# EAGLE design eCog108_Keyfob (EAGLE 6.6.0)
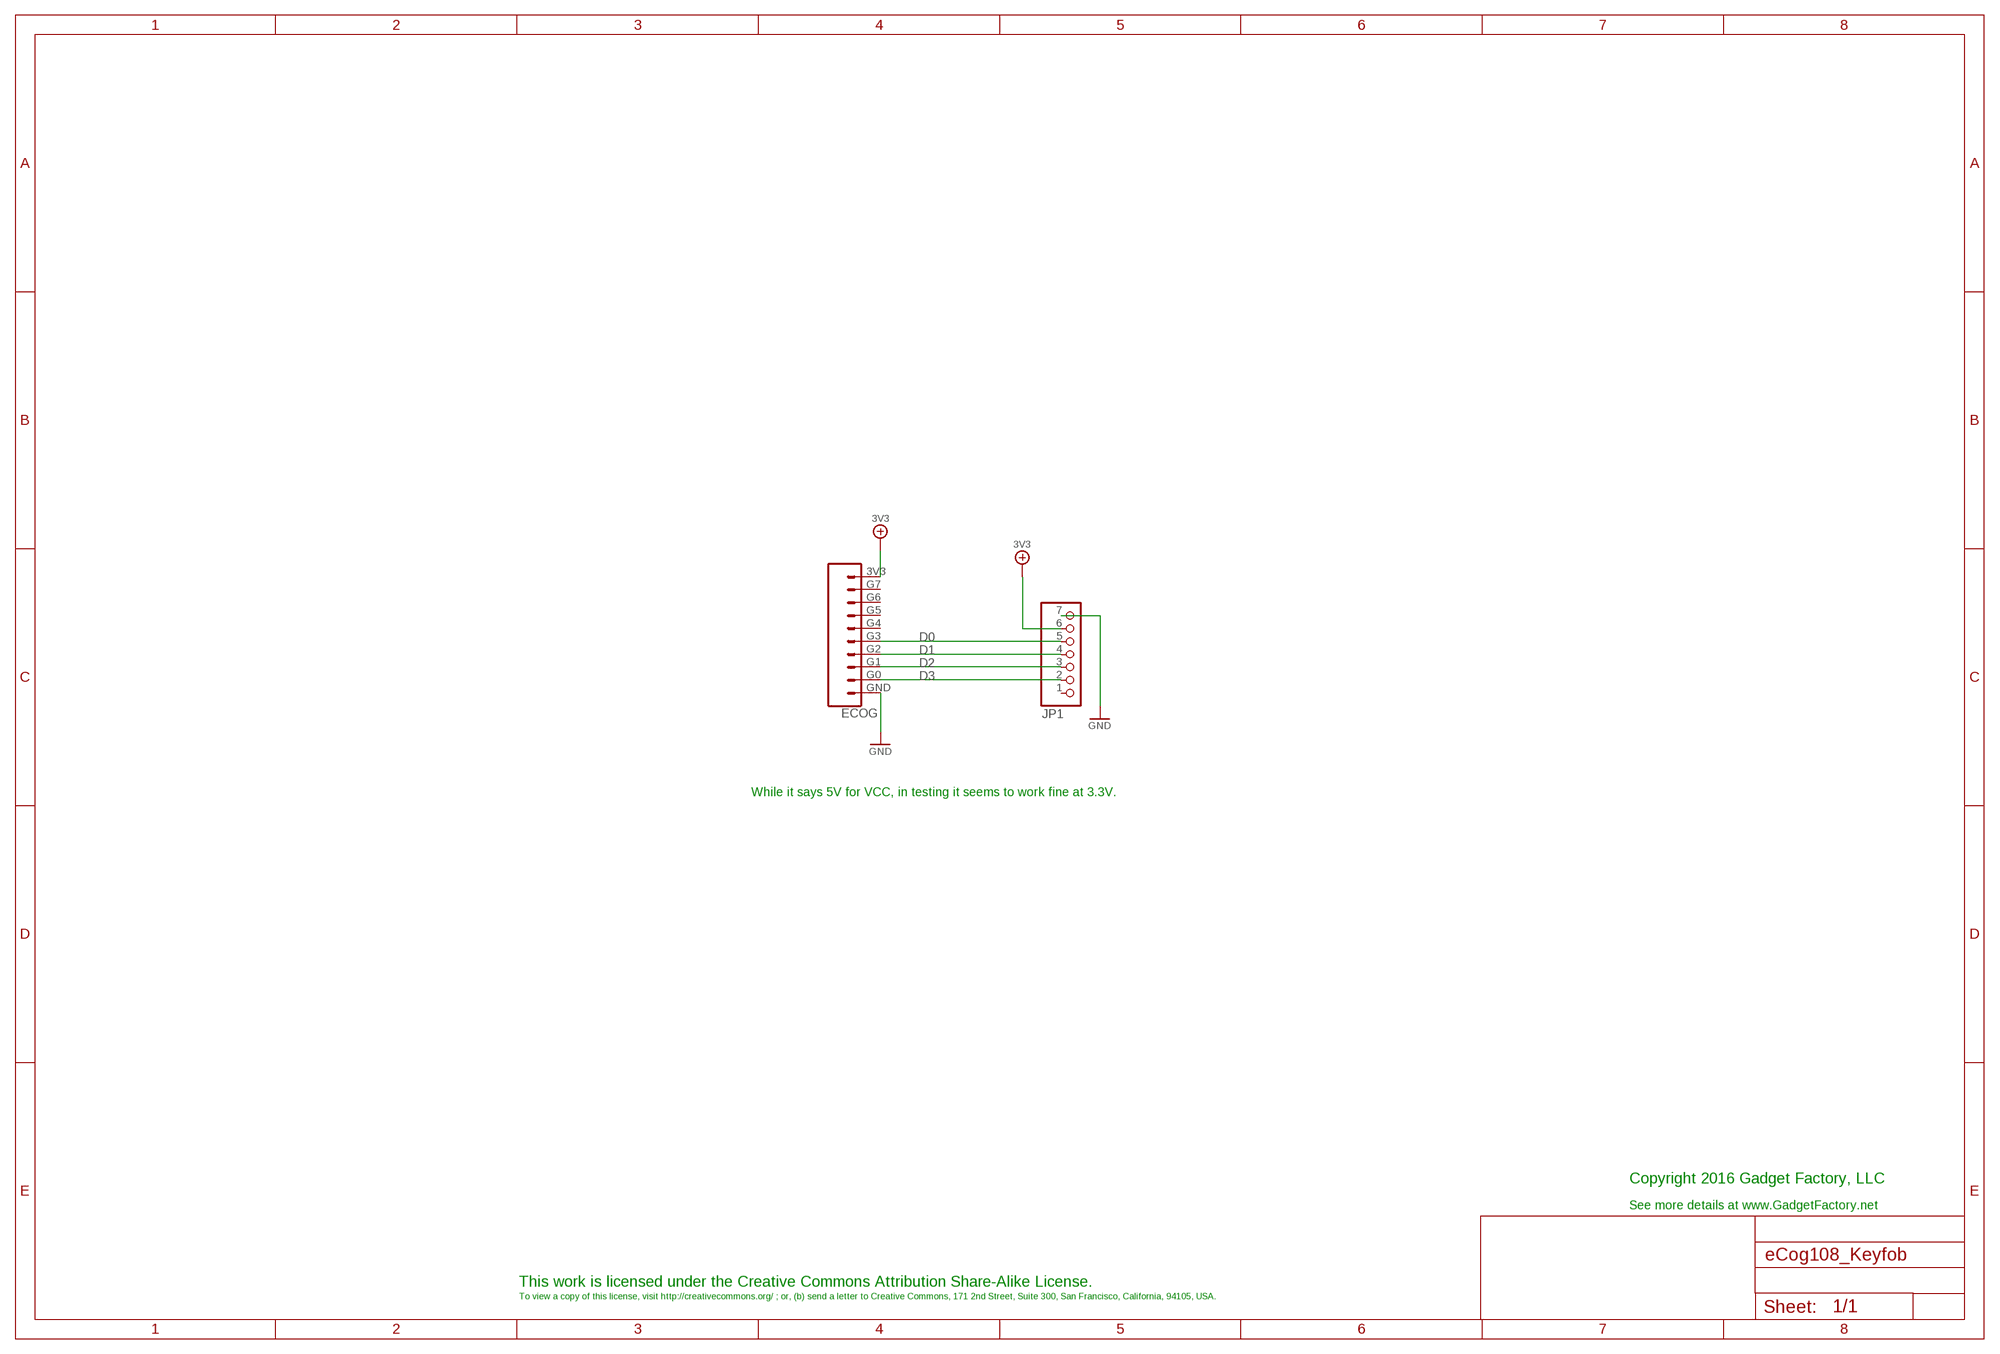
[diagram p0: schematic, sheet 1]

## Parts
ECOG  ECOG_GENERAL_ROWTHROUGHOLE  [ECOG_GENERAL_TH]
JP1  PINHD-1X7  [1X07]

## Nets
3V3: ECOG.3V3 JP1.6
D0: ECOG.G3 JP1.5
D1: ECOG.G2 JP1.4
D2: ECOG.G1 JP1.3
D3: ECOG.G0 JP1.2
GND: ECOG.GND JP1.7
Unconnected: ECOG.G4 ECOG.G5 ECOG.G6 ECOG.G7 JP1.1

## Notes on the sheet
- While it says 5V for VCC, in testing it seems to work fine at 3.3V.
- Copyright 2016 Gadget Factory, LLC
- See more details at www.GadgetFactory.net
- This work is licensed under the Creative Commons Attribution Share-Alike License.
- To view a copy of this license, visit http://creativecommons.org/ ; or, (b) send a letter to Creative Commons, 171 2nd Street, Suite 300, San Francisco, California, 94105, USA.

## Library data of the parts
ECOG = eCogs:ECOG_GENERAL_ROW
JP1 = pinhead:PINHD-1X7: PIN HEADER

## Board
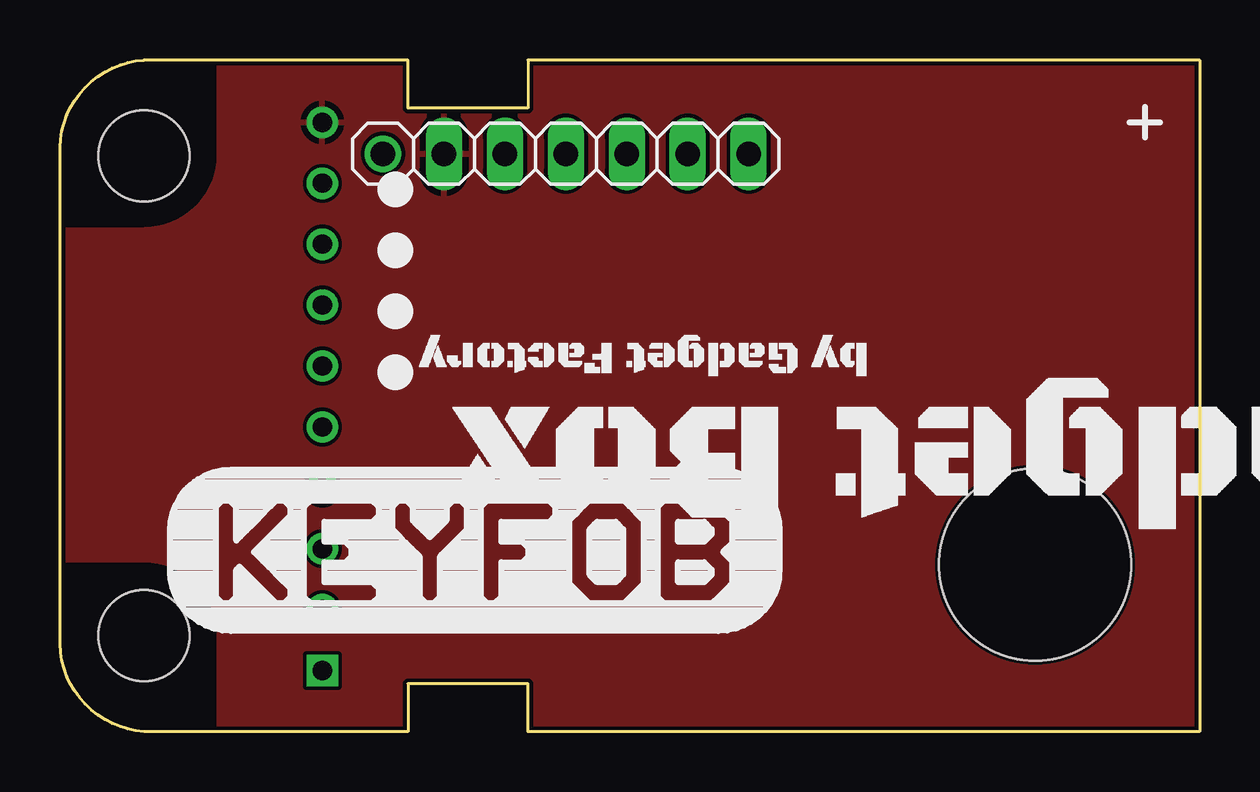
[diagram p1: board, top side]
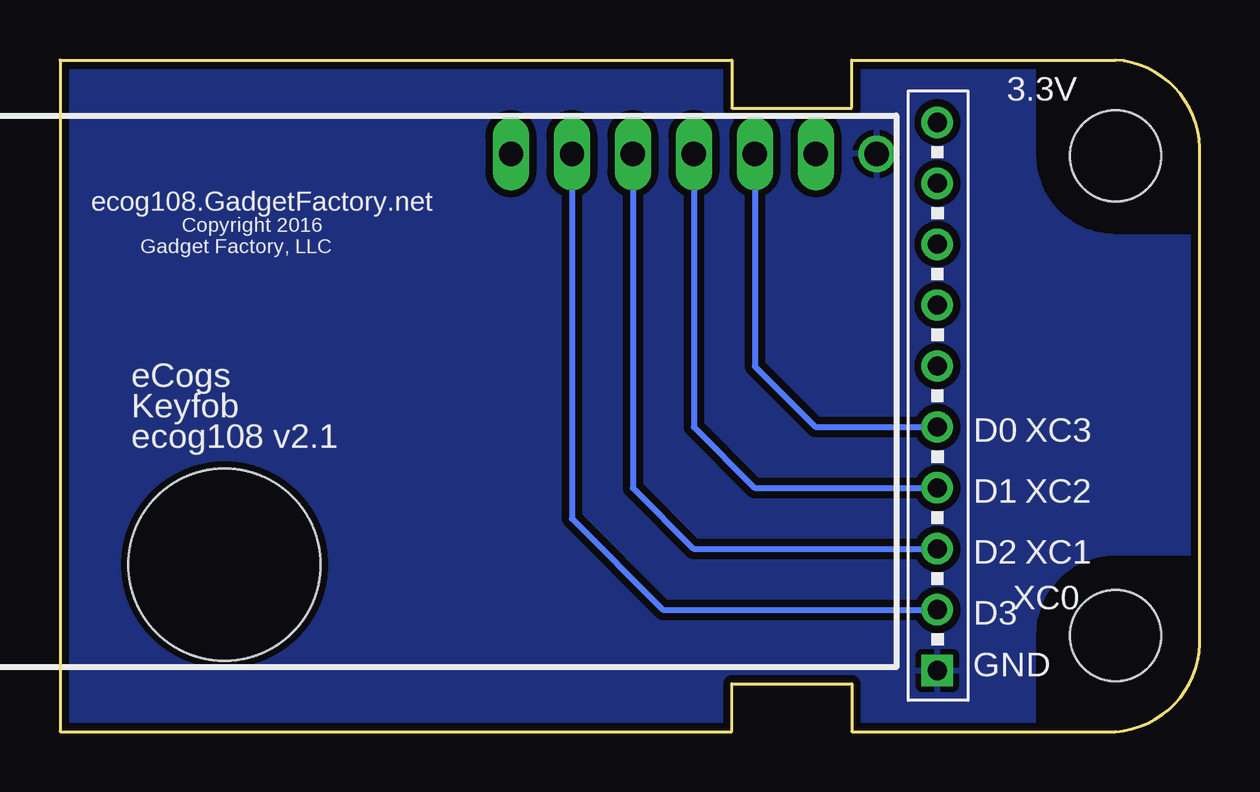
[diagram p2: board, bottom side, seen from below]

Size 47.51 x 28 mm. Coordinates in mm from the lower left corner, seen from the top.
Copper layers (1*16): Top 0.035mm / dielectric 1.5mm / Bottom 0.035mm
Design rules "hackvana *": minimum track width 6mil, minimum drill 0.3mm, track to track 6mil, track to pad 6mil, pad to pad 6mil, via to via 6mil, smd to smd 0mil, copper to edge 6mil, drill to drill 6mil, minimum pad ring 10mil, minimum via ring 6mil, stop-mask expansion 2mil, vias tented up to drill 100mil, thermal gap 10mil
Holes 8 mm at 40.65,6.96

### Footprints (pad centres in the part's own frame; a part is rotated, then mirrored left to right if it is on the bottom)
ECOG_GENERAL_TH = drill 0.8: 3V3 11.43,25.4; G0 11.43,5.08; G1 11.43,7.62; G2 11.43,10.16; G3 11.43,12.7; G4 11.43,15.24; G5 11.43,17.78; G6 11.43,20.32; G7 11.43,22.86 | drill 0.8 square: GND 11.43,2.54 | hole 3.8: 4,24; 4,4
1X07 = drill 1.016 long: 1 -7.62,0; 2 -5.08,0; 3 -2.54,0; 4 0,0; 5 2.54,0; 6 5.08,0 | drill 1.016: 7 7.62,0

### Placement (x,y rotation side)
ECOG  -0.49,0 0 top
JP1  21.09,24.09 180 top
U$1  [GADGETBOX_TEXT]  37.48,11.81 180 top
U$2  [LEGEND_DIO]  13.99,14.99 180 top
U$3  [LEGEND_DIO]  13.99,17.53 180 top
U$4  [LEGEND_DIO]  13.99,20.07 180 top
U$5  [LEGEND_DIO]  13.99,22.61 180 top

### Tracks (layer width: path | path; a pad name or v marks a point on that pad's centre or on a via)
3V3
  pour Top: -1.49,29 48.51,29 48.51,-1 -1.49,-1
D0
  Bottom 0.254: JP1.5 18.55,15.23 16.02,12.7 ECOG.G3
D1
  Bottom 0.254: JP1.4 21.09,12.69 18.56,10.16 ECOG.G2
D2
  Bottom 0.254: JP1.3 23.63,10.15 21.1,7.62 ECOG.G1
D3
  Bottom 0.254: JP1.2 26.17,8.88 22.37,5.08 ECOG.G0
GND
  pour Bottom (isolate 0.305): -2.49,30 49.51,30 49.51,-2 -2.49,-2

### Text on the board
bPlace: 3.3V | ecog108.GadgetFactory.net | Copyright 2016 | Gadget Factory, LLC | eCogs | Keyfob | XC3 | D0 | ecog108 v2.1 | XC2 | D1 | XC1 | D2 | XC0 | D3 | GND